# EAGLE design FeatherwingCircuit (EAGLE 9.2.2)
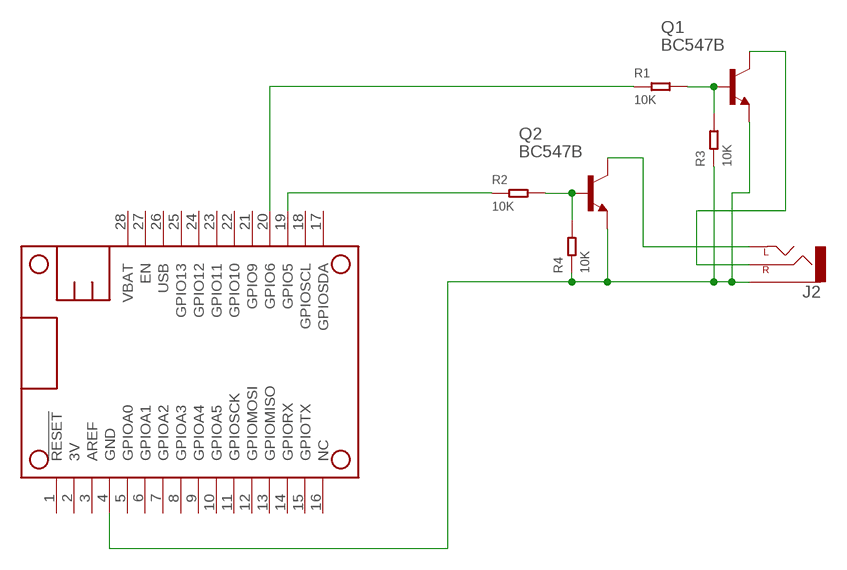
[diagram p0: schematic, sheet 1]

## Parts
J2  AUDIO_JACK_2.5MM_2.5MM  [STEREOJACK2.5MM_STEREOJACK2.5MM]
MS1  FEATHERWING_NODIM  [FEATHERWING_DIM]
Q1  BC547B  [TO92]
Q2  BC547B  [TO92]
R1  10K  DIP-RES-10K-5%-1/4W(PR-D2.3XL6.5MM)  [PR-D2.3XL6.5MM]
R2  10K  DIP-RES-10K-5%-1/4W(PR-D2.3XL6.5MM)  [PR-D2.3XL6.5MM]
R3  10K  DIP-RES-10K-5%-1/4W(PR-D2.3XL6.5MM)  [PR-D2.3XL6.5MM]
R4  10K  DIP-RES-10K-5%-1/4W(PR-D2.3XL6.5MM)  [PR-D2.3XL6.5MM]

## Nets
GND: J2.RING1(SLEEVE) MS1.4(GND) Q1.1(E) Q2.1(E) R3.1 R4.1
N$1: Q1.2(B) R1.2 R3.2
N$2: Q2.2(B) R2.2 R4.2
N$3: J2.TIP(RIGHT) Q1.3(C)
N$4: J2.SHIELD(LEFT) Q2.3(C)
N$6: MS1.19(GPIO5) R2.1
N$7: MS1.20(GPIO6) R1.1
Unconnected: MS1.1(!RESET) MS1.2(3V) MS1.3(AREF) MS1.5(GPIOA0) MS1.6(GPIOA1) MS1.7(GPIOA2) MS1.8(GPIOA3) MS1.9(GPIOA4) MS1.10(GPIOA5) MS1.11(GPIOSCK) MS1.12(GPIOMOSI) MS1.13(GPIOMISO) MS1.14(GPIORX) MS1.15(GPIOTX) MS1.16(NC) MS1.17(GPIOSDA) MS1.18(GPIOSCL) MS1.21(GPIO9) MS1.22(GPIO10) MS1.23(GPIO11) MS1.24(GPIO12) MS1.25(GPIO13) MS1.26(USB) MS1.27(EN) MS1.28(VBAT)

## Library data of the parts
J2 = SparkFun-Connectors:AUDIO_JACK_2.5MM: Audio Jack 2.5mm variants of PTH and SMT audio jacks. SparkFun Products: SparkFun PicoBoard <https://www.sparkfun.com/products/11888>- 2.5mm SMD; PROD_ID: CONN-09878
MS1 = adafruit:FEATHERWING
Q1 Q2 = transistor-npn:BC547*: NPN Transistor
R1-R4 = Seeed-Resistor:DIP-RES-10K-5%-1/4W(PR-D2.3XL6.5MM): 301020001; MPN: FHCFR-1/4W-103J

## Board
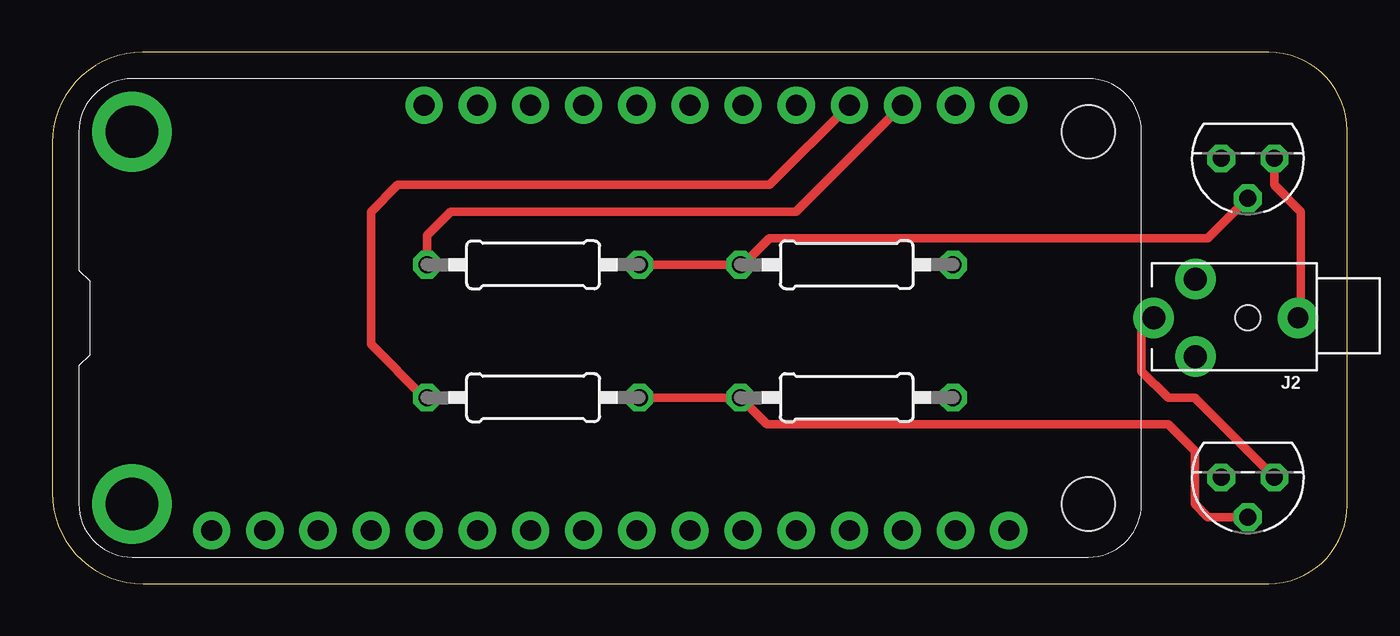
[diagram p1: board, top side]
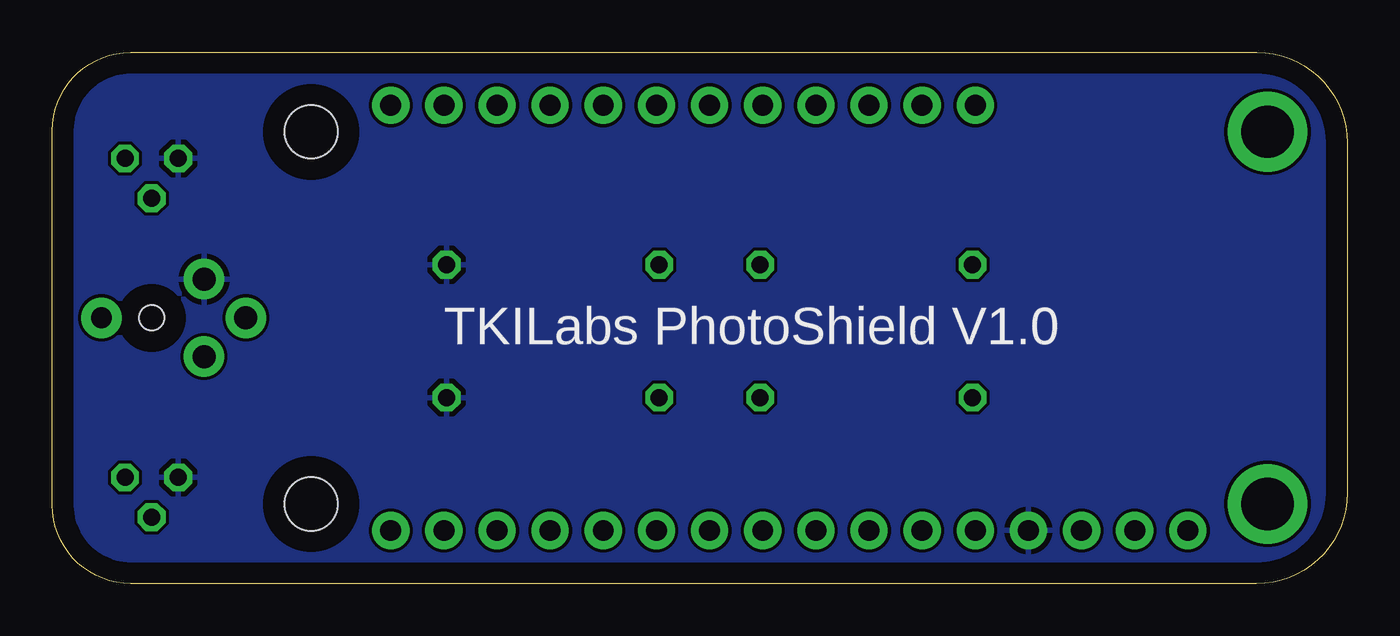
[diagram p2: board, bottom side, seen from below]

Size 61.9 x 25.39 mm. Coordinates in mm from the lower left corner, seen from the top.
Outline: 0,21.07 0,4.34 arc90 4.34,0 58.15,0 arc90 61.9,3.75 61.9,21.65 arc90 58.16,25.39 4.32,25.39 arc90 0,21.07
Copper layers (1*16): Top 0.035mm / dielectric 1.5mm / Bottom 0.035mm
Design rules "default": minimum track width 6mil, minimum drill 0.35mm, track to track 6mil, track to pad 6mil, pad to pad 6mil, via to via 6mil, smd to smd 6mil, copper to edge 40mil, drill to drill 6mil, minimum pad ring 10mil, minimum via ring 8mil, stop-mask expansion 4mil, vias tented up to drill 0mil, thermal gap 10mil

### Footprints (pad centres in the part's own frame; a part is rotated, then mirrored left to right if it is on the bottom)
STEREOJACK2.5MM_STEREOJACK2.5MM = drill 1.1 pad 1.93: RING1 2.5,-1.85; RING2 2.5,1.85; TIP 4.5,0 | drill 1 pad 1.93: SHIELD -2.4,0 | hole 1.2: 0,0
FEATHERWING_DIM = drill 1 pad 1.778: 1 6.35,1.27; 2 8.89,1.27; 3 11.43,1.27; 4 13.97,1.27; 5 16.51,1.27; 6 19.05,1.27; 7 21.59,1.27; 8 24.13,1.27; 9 26.67,1.27; 10 29.21,1.27; 11 31.75,1.27; 12 34.29,1.27; 13 36.83,1.27; 14 39.37,1.27; 15 41.91,1.27; 16 44.45,1.27; 17 44.45,21.59; 18 41.91,21.59; 19 39.37,21.59; 20 36.83,21.59; 21 34.29,21.59; 22 31.75,21.59; 23 29.21,21.59; 24 26.67,21.59; 25 24.13,21.59; 26 21.59,21.59; 27 19.05,21.59; 28 16.51,21.59 | drill 2.5 pad 3.81: P$1 2.54,20.32; P$2 2.54,2.54 | hole 2.54: 48.26,20.32; 48.26,2.54
TO92 = drill 0.813 octagon: 1 1.27,0; 2 0,1.905; 3 -1.27,0
PR-D2.3XL6.5MM = drill 0.813 octagon: 1 -4.953,0; 2 5.207,0

### Placement (x,y rotation side)
J2  57.15,12.7 180 top
MS1  1.27,1.27 0 top
Q1  57.15,5.08 180 top
Q2  57.15,20.32 180 top
R1  22.86,8.89 0 top
R2  22.86,15.24 0 top
R3  38.1,8.89 180 top
R4  38.1,15.24 180 top

### Tracks (layer width: path | path; a pad name or v marks a point on that pad's centre or on a via)
GND
  pour Bottom: -1.27,26.67 72.39,26.67 72.39,-1.27 -1.27,-1.27
N$1
  Top 0.406: R1.2 R3.2 34.16,7.62 53.34,7.62 54.61,6.35 54.61,3.81 55.24,3.17 Q1.2
N$2
  Top 0.406: R2.2 R4.2 33.02,15.24 34.29,16.51 55.24,16.51 Q2.2
N$3
  Top 0.406: Q1.3 54.61,8.89 53.34,8.89 52.07,10.16 52.07,12.12 J2.TIP
N$4
  Top 0.406: Q2.3 58.42,19.05 59.69,17.78 59.69,12.84 J2.SHIELD
N$6
  Top 0.406: R2.1 17.91,16.64 19.05,17.78 35.56,17.78 MS1.19
N$7
  Top 0.254: 17.78,8.89 R1.1
  Top 0.406: 17.78,8.89 15.24,11.43 15.24,17.78 16.51,19.05 34.29,19.05 MS1.20

### Text on the board
bNames: TKILabs PhotoShield V1.0